# Altium schematic sheet SHEET_MAP.SchDoc
size Tabloid; SheetNumber: 1; SheetTotal: 7
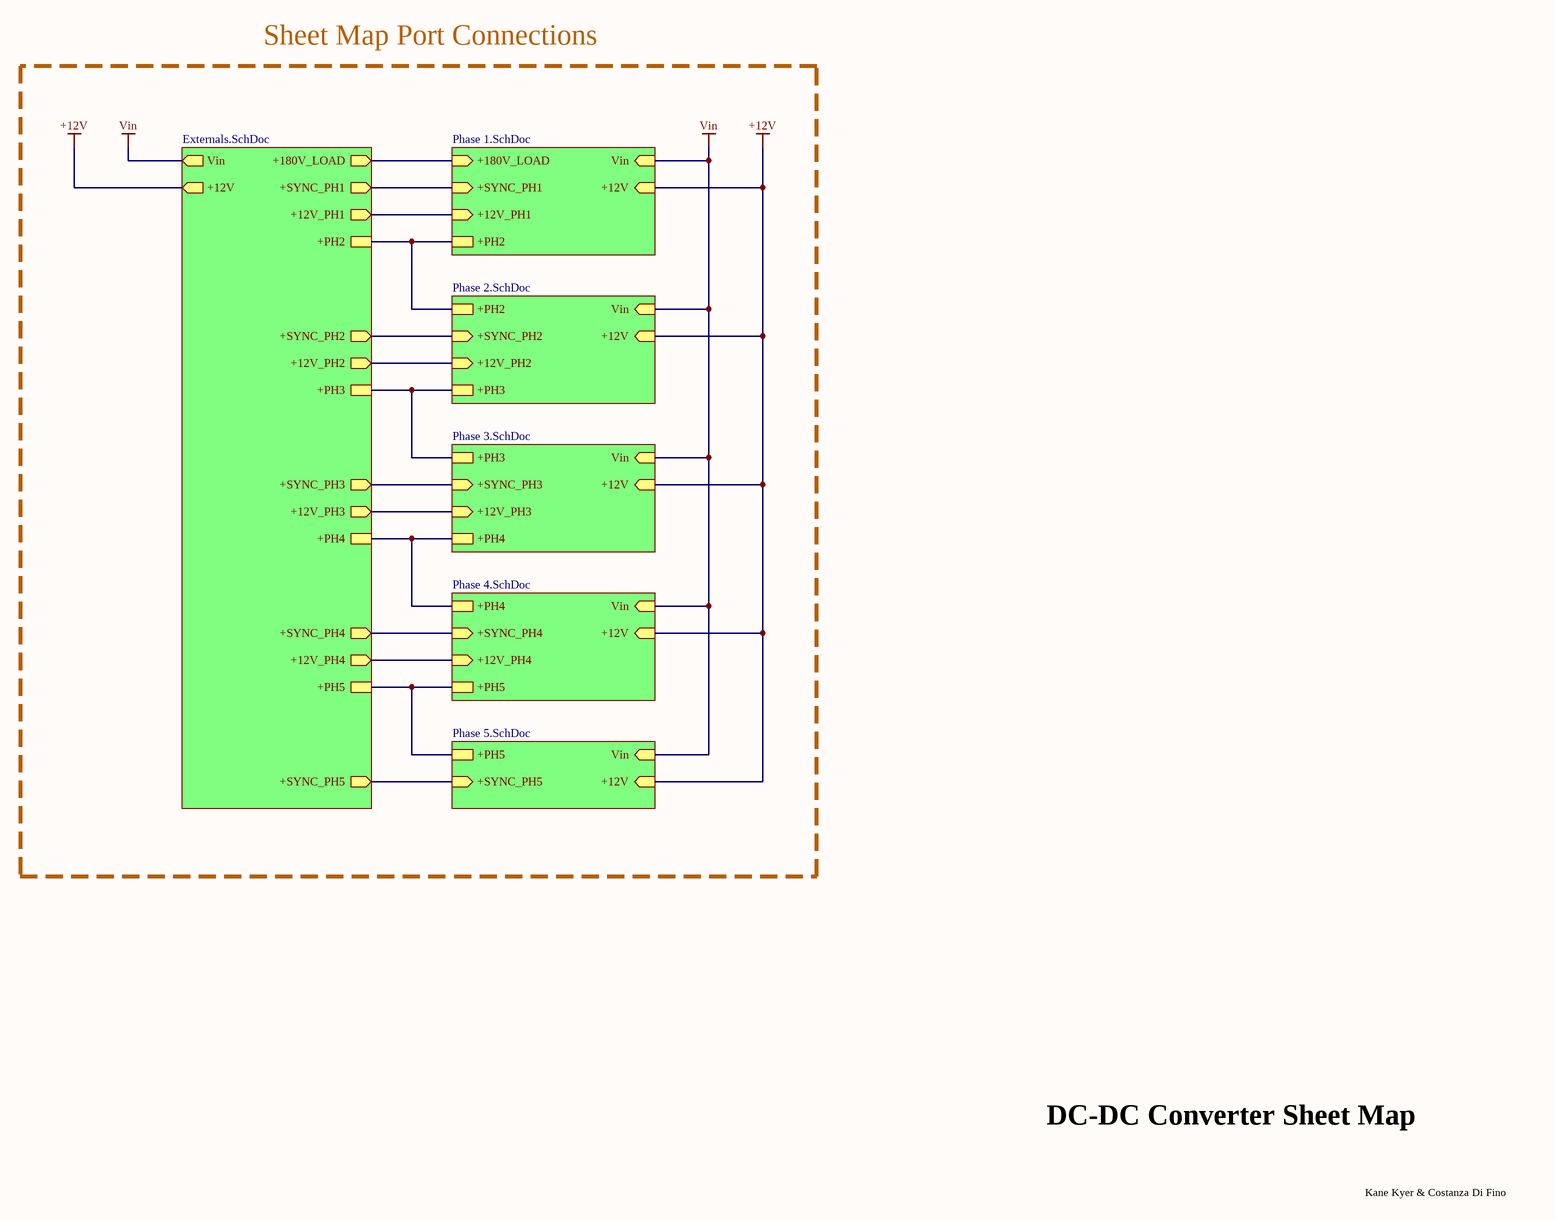
[diagram p0: SHEET_MAP.SchDoc]

## Sub-sheets
U_EXTERNAL = Externals.SchDoc: +SYNC_PH1 (out), +SYNC_PH2 (out), +SYNC_PH3 (out), +SYNC_PH4 (out), +SYNC_PH5 (out), +180V_LOAD (out), Vin (out), +12V (out), +12V_PH1 (out), +12V_PH2 (out), +12V_PH3 (out), +12V_PH4 (out), +PH2, +PH3, +PH4, +PH5
U_LTC3751_PH1 = Phase 1.SchDoc: +SYNC_PH1 (in), +180V_LOAD (in), Vin (in), +12V (in), +12V_PH1 (in), +PH2
U_LTC3751_PH2 = Phase 2.SchDoc: +SYNC_PH2 (in), Vin (in), +12V (in), +12V_PH2 (in), +PH3, +PH2
U_LTC3751_PH3 = Phase 3.SchDoc: +SYNC_PH3 (in), Vin (in), +12V (in), +12V_PH3 (in), +PH3, +PH4
U_LTC3751_PH4 = Phase 4.SchDoc: +SYNC_PH4 (in), Vin (in), +12V (in), +12V_PH4 (in), +PH4, +PH5
U_LTC3751_PH5 = Phase 5.SchDoc: +SYNC_PH5 (in), Vin (in), +12V (in), +PH5

## Nets
+12V: sheet U_EXTERNAL/+12V, sheet U_LTC3751_PH1/+12V, sheet U_LTC3751_PH2/+12V, sheet U_LTC3751_PH3/+12V, sheet U_LTC3751_PH4/+12V, sheet U_LTC3751_PH5/+12V
Vin: sheet U_EXTERNAL/Vin, sheet U_LTC3751_PH1/Vin, sheet U_LTC3751_PH2/Vin, sheet U_LTC3751_PH3/Vin, sheet U_LTC3751_PH4/Vin, sheet U_LTC3751_PH5/Vin
(unnamed): sheet U_EXTERNAL/+SYNC_PH1, sheet U_LTC3751_PH1/+SYNC_PH1
(unnamed): sheet U_EXTERNAL/+SYNC_PH2, sheet U_LTC3751_PH2/+SYNC_PH2
(unnamed): sheet U_EXTERNAL/+SYNC_PH3, sheet U_LTC3751_PH3/+SYNC_PH3
(unnamed): sheet U_EXTERNAL/+SYNC_PH4, sheet U_LTC3751_PH4/+SYNC_PH4
(unnamed): sheet U_EXTERNAL/+SYNC_PH5, sheet U_LTC3751_PH5/+SYNC_PH5
(unnamed): sheet U_EXTERNAL/+180V_LOAD, sheet U_LTC3751_PH1/+180V_LOAD
(unnamed): sheet U_EXTERNAL/+12V_PH1, sheet U_LTC3751_PH1/+12V_PH1
(unnamed): sheet U_EXTERNAL/+12V_PH2, sheet U_LTC3751_PH2/+12V_PH2
(unnamed): sheet U_EXTERNAL/+12V_PH3, sheet U_LTC3751_PH3/+12V_PH3
(unnamed): sheet U_EXTERNAL/+12V_PH4, sheet U_LTC3751_PH4/+12V_PH4
(unnamed): sheet U_EXTERNAL/+PH2, sheet U_LTC3751_PH1/+PH2, sheet U_LTC3751_PH2/+PH2
(unnamed): sheet U_EXTERNAL/+PH3, sheet U_LTC3751_PH2/+PH3, sheet U_LTC3751_PH3/+PH3
(unnamed): sheet U_EXTERNAL/+PH4, sheet U_LTC3751_PH3/+PH4, sheet U_LTC3751_PH4/+PH4
(unnamed): sheet U_EXTERNAL/+PH5, sheet U_LTC3751_PH4/+PH5, sheet U_LTC3751_PH5/+PH5

## Notes on the sheet
- Sheet Map Port Connections
- DC-DC Converter Sheet Map
- Kane Kyer & Costanza Di Fino